# Altium schematic sheet A2000_slot_connector.SchDoc
size A4
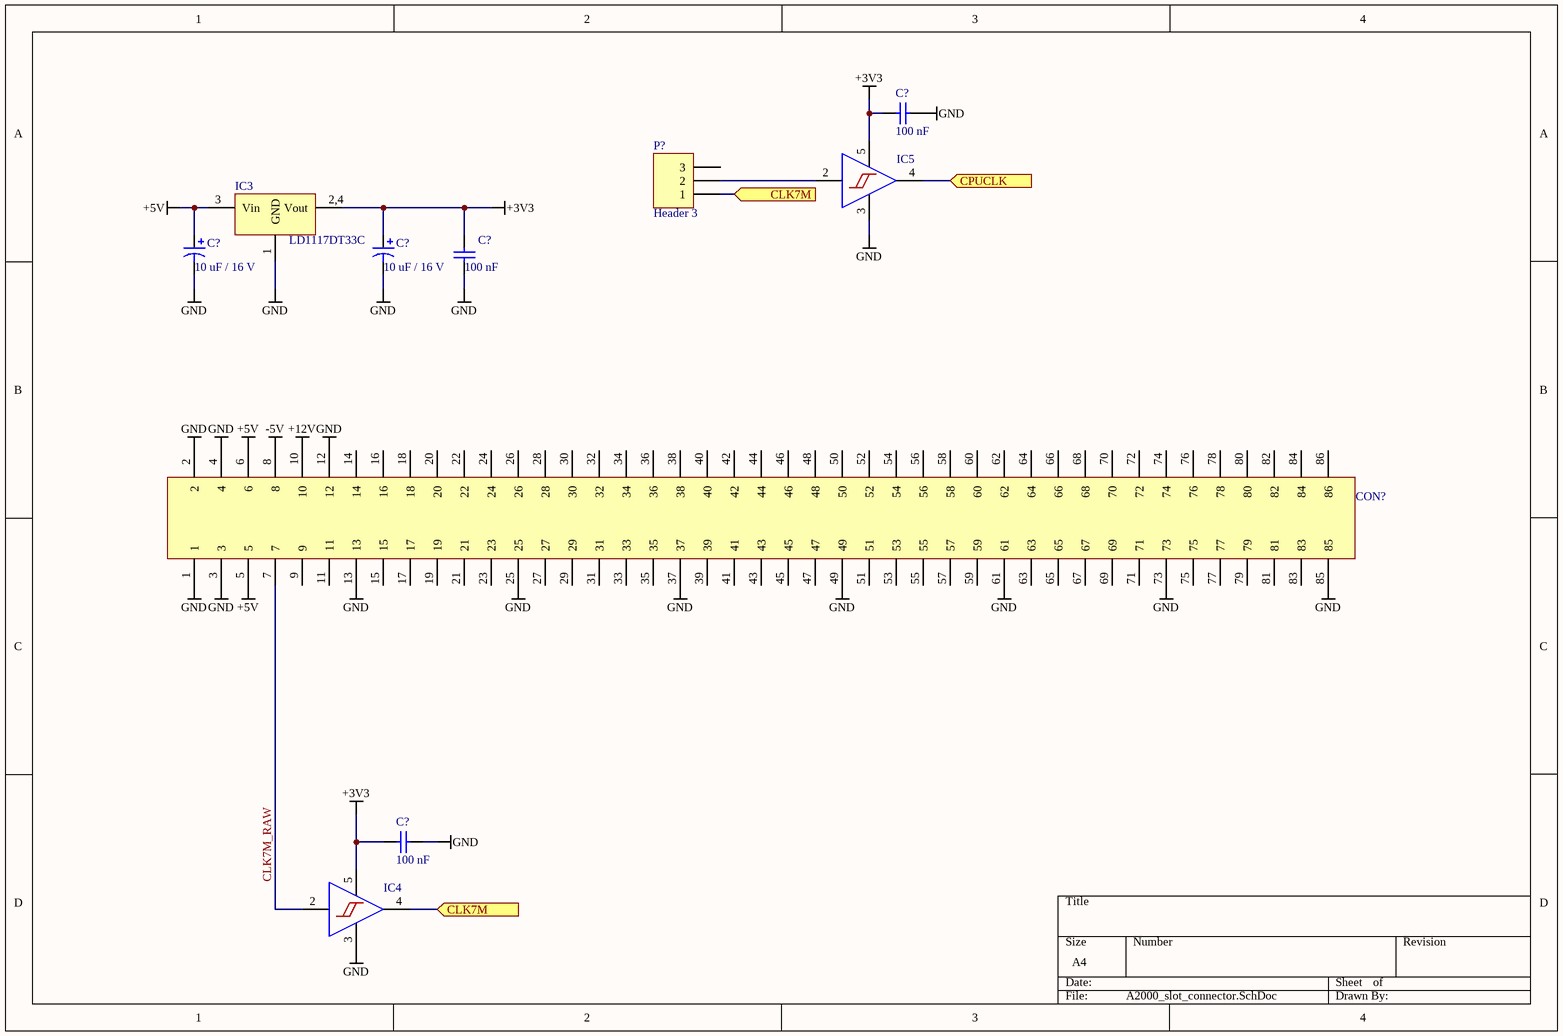
[diagram p0: A2000_slot_connector.SchDoc]

## Parts
(Parts that share a designator on the sheet are numbered #1, #2 ... from top to bottom, then left to right.)
C?#1  value 100 nF  [C1206]  (hidden comment: Cap Semi)
C?#2  value 10 uF / 16 V  [Electrolytic Capacitor Size B]  (hidden comment: Cap Pol1)
C?#3  value 10 uF / 16 V  [Electrolytic Capacitor Size B]  (hidden comment: Cap Pol1)
C?#4  value 100 nF  [C1206]  (hidden comment: Cap Semi)
C?#5  value 100 nF  [C1206]  (hidden comment: Cap Semi)
CON?  A2000-CPU-SLOT  [A2000-CPU-slot]  (value not drawn)
IC3  LD1117DT33C  [SOT-223-3]
IC4  74x1G17DBV  [SOT-23-5]  (value not drawn)
IC5  74x1G17DBV  [SOT-23-5]  (value not drawn)
P?  Header 3  [Pin Header 1x3 TH Pitch 2.54mm]

## Ports
CLK7M, CPUCLK

## Nets
+3V3: C?#1.2 C?#3.1 C?#4.2 C?#5.2 IC3.2,4(Vout) IC4.5(GND) IC5.5(GND)
+5V: C?#2.1 CON?.5 CON?.6 IC3.3(Vin)
+12V: CON?.10
-5V: CON?.8
GND: C?#1.1 C?#2.2 C?#3.2 C?#4.1 C?#5.1 CON?.1 CON?.2 CON?.3 CON?.4 CON?.12 CON?.13 CON?.25 CON?.37 CON?.49 CON?.61 CON?.73 CON?.85 IC3.1(GND) IC4.3(GND) IC5.3(GND)
CLK7M: IC4.4(GND) P?.1 ; port CLK7M
CLK7M_RAW: CON?.7 IC4.2(A)
CPUCLK: IC5.4(GND) ; port CPUCLK
NetIC5_2: IC5.2(A) P?.2

Not connected (* = marked no-connect by the designer): CON? 9 11 14 15 16 17 18 19 20 21 22 23 24 26 27 28 29 30 31 32 33 34 35 36 38 39 40 41 42 43 44 45 46 47 48 50 51 52 53 54 55 56 57 58 59 60 62 63 64 65 66 67 68 69 70 71 72 74 75 76 77 78 79 80 81 82 83 84 86; P? 3

## Library data of the parts
C?#1 C?#4 C?#5 = Cap Semi: Capacitor (Semiconductor SIM Model); Published: 8-Jun-2000; LatestRevisionDate: 29-May-2009; LatestRevisionNote: IPC-7351 Footprint Added.; PackageReference: C1206; Publisher: Altium Limited; PackageDescription: Chip Capacitor
C?#2 C?#3 = Cap Pol1: Polarized Capacitor (Radial); Published: 8-Jun-2000; LatestRevisionDate: 17-Jul-2002; LatestRevisionNote: Re-released for DXP Platform.; PackageReference: RB7.6-15; Publisher: Altium Limited; PackageDescription: Polarized Capacitor (Radial); 2 Leads
CON? = A2000-CPU-SLOT: Edge connector for A200 coprocessor card
IC4 IC5 = 74LVC1G17DBV: Single Schmitt buffer
P? = Header 3: Header, 3-Pin; LatestRevisionDate: 17-Jul-2002; LatestRevisionNote: Re-released for DXP Platform.; Publisher: Altium Limited